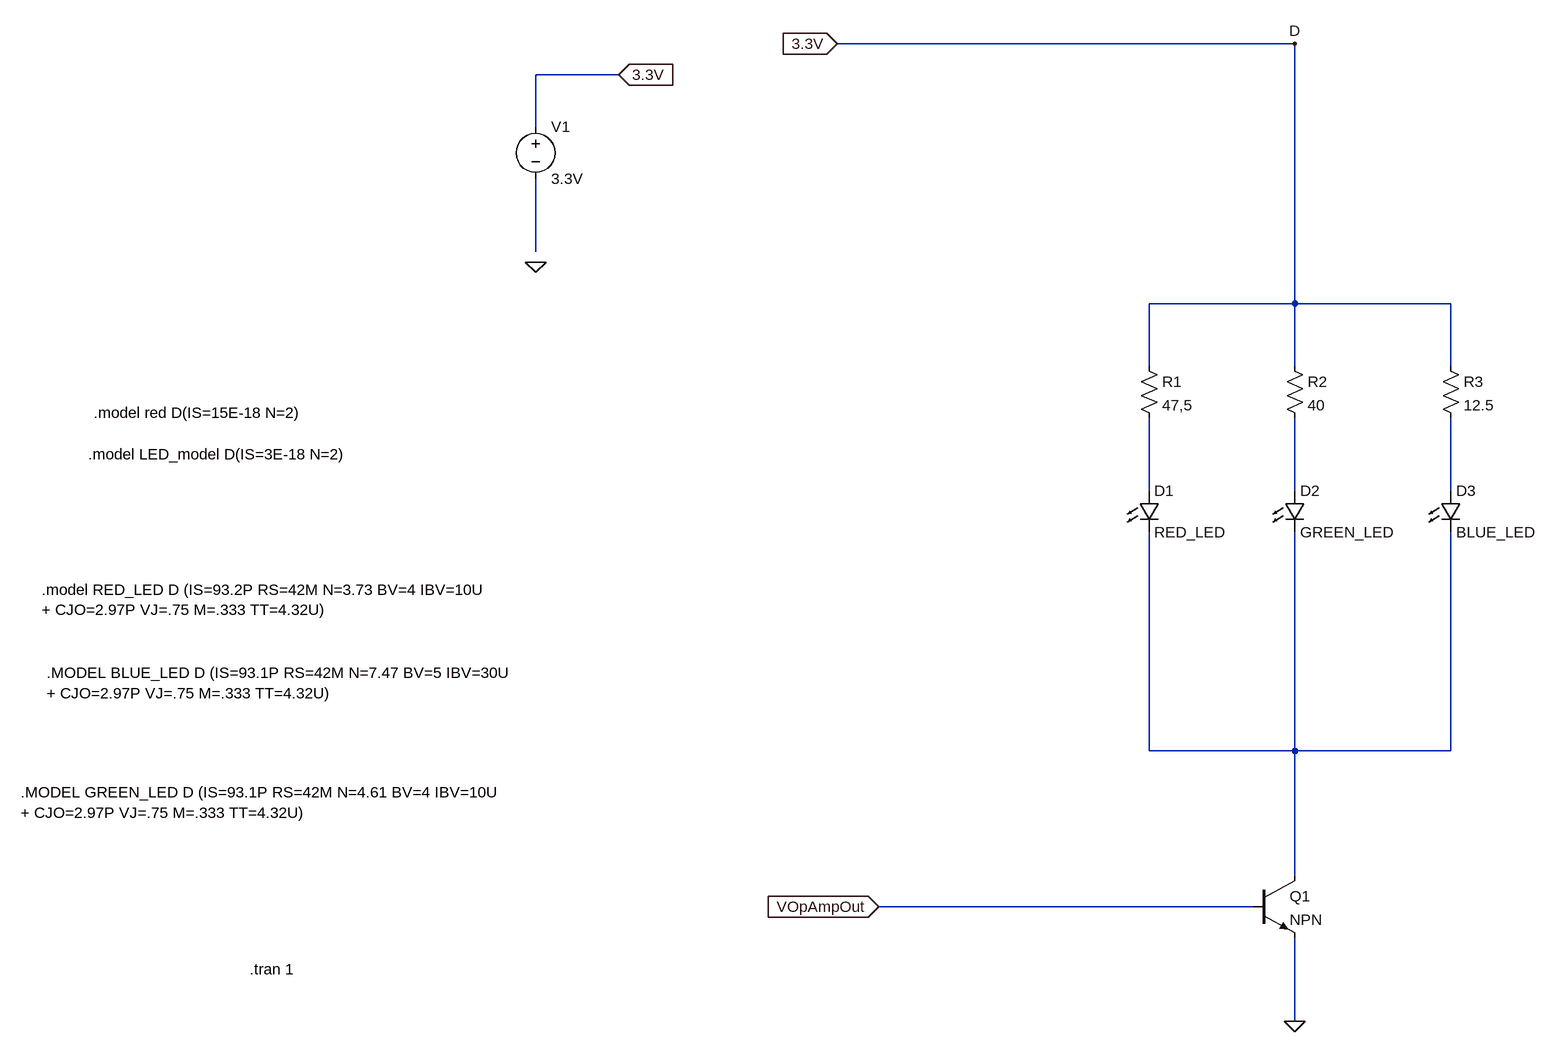
[diagram p0: schematic LED_Circuit_new.asc]
LED_Circuit_new.asc, the LTspice schematic file:
Version 4
SHEET 1 2152 980
WIRE 688 -544 -16 -544
WIRE -352 -496 -480 -496
WIRE -480 -416 -480 -496
WIRE -480 -224 -480 -336
WIRE 688 -144 688 -544
WIRE 688 -144 464 -144
WIRE 928 -144 688 -144
WIRE 464 -48 464 -144
WIRE 688 -48 688 -144
WIRE 928 -48 928 -144
WIRE 464 144 464 32
WIRE 688 144 688 32
WIRE 928 144 928 32
WIRE 464 544 464 208
WIRE 688 544 688 208
WIRE 688 544 464 544
WIRE 928 544 928 208
WIRE 928 544 688 544
WIRE 688 736 688 544
WIRE 624 784 48 784
WIRE 688 960 688 832
FLAG 688 960 0
FLAG 688 -544 D
FLAG 48 784 VOpAmpOut
IOPIN 48 784 In
FLAG -16 -544 3.3V
IOPIN -16 -544 In
FLAG -480 -208 0
FLAG -352 -496 3.3V
IOPIN -352 -496 In
SYMBOL LED 448 144 R0
SYMATTR InstName D1
SYMATTR Value RED_LED
SYMBOL LED 672 144 R0
SYMATTR InstName D2
SYMATTR Value GREEN_LED
SYMBOL LED 912 144 R0
SYMATTR InstName D3
SYMATTR Value BLUE_LED
SYMBOL res 448 -64 R0
SYMATTR InstName R1
SYMATTR Value 47,5
SYMBOL res 672 -64 R0
SYMATTR InstName R2
SYMATTR Value 40
SYMBOL res 912 -64 R0
SYMATTR InstName R3
SYMATTR Value 12.5
SYMBOL npn 624 736 R0
SYMATTR InstName Q1
SYMBOL voltage -480 -432 R0
SYMATTR InstName V1
SYMATTR Value 3.3V
TEXT -1168 88 Left 2 !.model LED_model D(IS=3E-18 N=2)
TEXT -920 880 Left 2 !.tran 1
TEXT -1160 24 Left 2 !.model red D(IS=15E-18 N=2)
TEXT -1240 296 Left 2 !.model RED_LED D (IS=93.2P RS=42M N=3.73 BV=4 IBV=10U\n+ CJO=2.97P VJ=.75 M=.333 TT=4.32U)
TEXT -1232 424 Left 2 !.MODEL BLUE_LED D (IS=93.1P RS=42M N=7.47 BV=5 IBV=30U\n+ CJO=2.97P VJ=.75 M=.333 TT=4.32U)
TEXT -1272 608 Left 2 !.MODEL GREEN_LED D (IS=93.1P RS=42M N=4.61 BV=4 IBV=10U\n+ CJO=2.97P VJ=.75 M=.333 TT=4.32U)

The netlist it stands for:
* LED_Circuit_new.asc
D1 N002 N005 RED_LED
D2 N003 N005 GREEN_LED
D3 N004 N005 BLUE_LED
R1 3.3V N002 47,5
R2 3.3V N003 40
R3 3.3V N004 12.5
Q1 N005 VOpAmpOut 0 0 NPN
V1 3.3V N001 3.3V
.model D D
.lib standard.dio
.model NPN NPN
.model PNP PNP
.lib standard.bjt
.model LED_model D(IS=3E-18 N=2)
.tran 1
.model red D(IS=15E-18 N=2)
.model RED_LED D (IS=93.2P RS=42M N=3.73 BV=4 IBV=10U
+ CJO=2.97P VJ=.75 M=.333 TT=4.32U)
.MODEL BLUE_LED D (IS=93.1P RS=42M N=7.47 BV=5 IBV=30U
+ CJO=2.97P VJ=.75 M=.333 TT=4.32U)
.MODEL GREEN_LED D (IS=93.1P RS=42M N=4.61 BV=4 IBV=10U
+ CJO=2.97P VJ=.75 M=.333 TT=4.32U)
.backanno
.end